# Altium schematic sheet Blue_Pill_v1.0.SchDoc
size OrCAD A; SheetNumber: 1; SheetTotal: 1
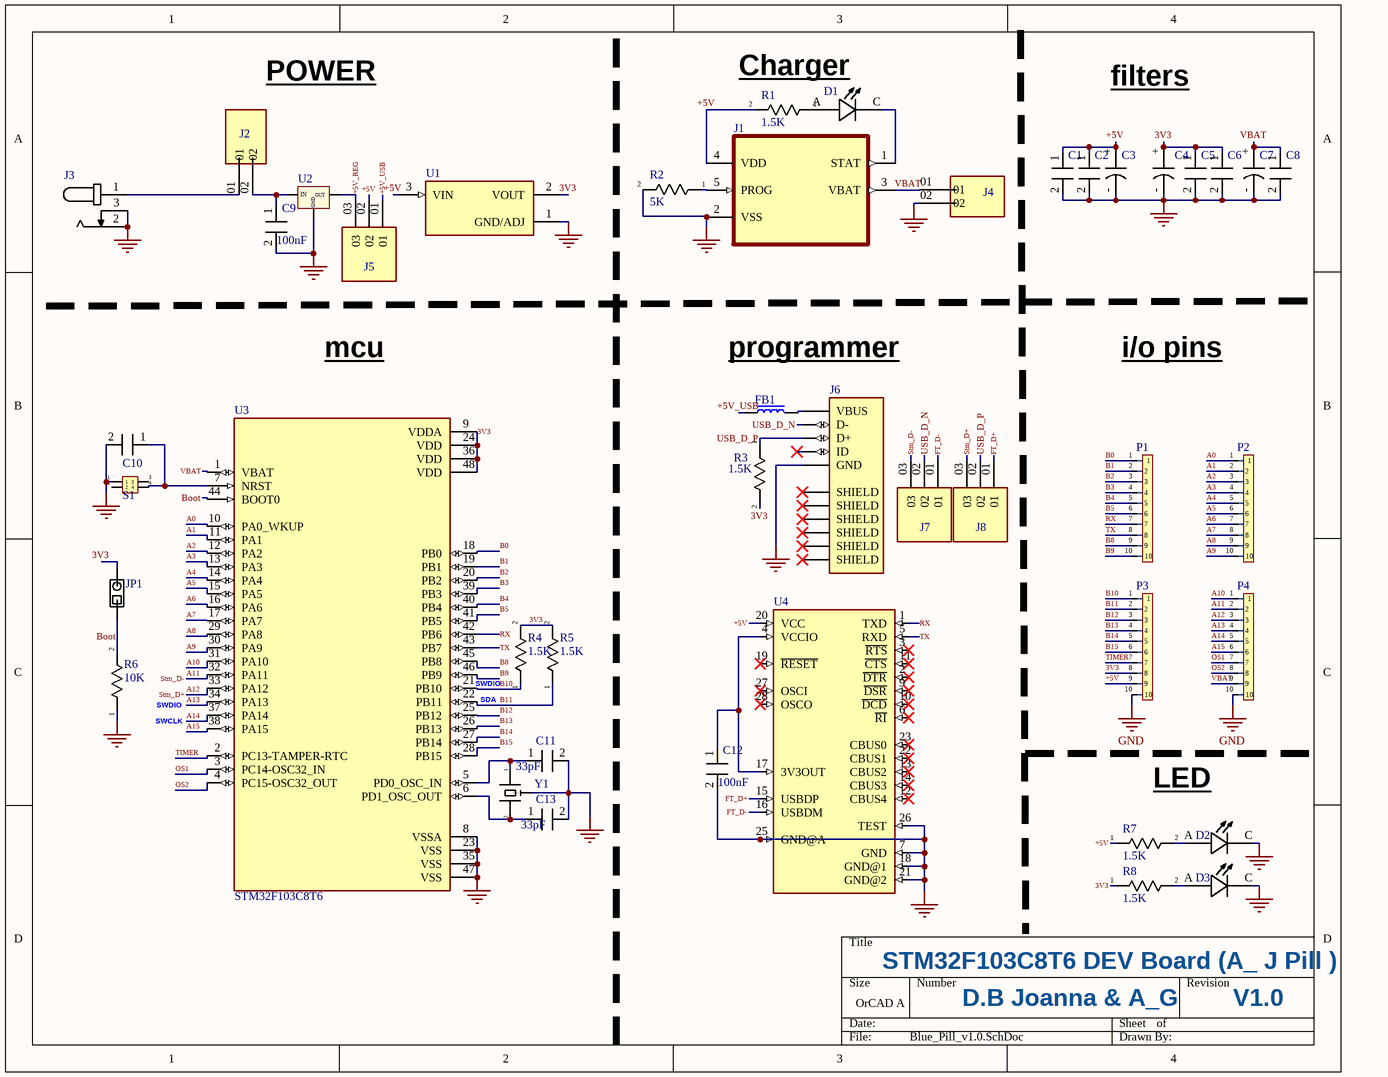
[diagram p0: Blue_Pill_v1.0.SchDoc]

## Parts
C1  10nF  [CL21B104KACNNNC]  (value not drawn)
C2  100nF  [CL21B104KACNNNC]  (value not drawn)
C3  2.2UF  [10SVP4R7M]  (value not drawn)
C4  2.2UF  [10SVP4R7M]  (value not drawn)
C5  100nF  [CL21B104KACNNNC]  (value not drawn)
C6  10nF  [CL21B104KACNNNC]  (value not drawn)
C7  2.2UF  [10SVP4R7M]  (value not drawn)
C8  100nF  [CL21B104KACNNNC]  (value not drawn)
C9  100nF  [CL21B104KACNNNC]
C10  100nF  [CL21B104KACNNNC]  (value not drawn)
C11  33pF  [CC0805JKX7R7BB105]
C12  100nF  [CL21B104KACNNNC]
C13  33pF  [CC0805JKX7R7BB105]
D1  LEDC2012X70N  [LEDC2012X70N]  (value not drawn)
D2  LEDC2012X70N  [LEDC2012X70N]  (value not drawn)
D3  LEDC2012X70N  [LEDC2012X70N]  (value not drawn)
FB1  FB0805  [FB_0805]  (value not drawn)
J1  MCP73831T-2ACI/OT  [MCP73831_SOT95P280X145-5N]  (value not drawn)
J2  PINHEADER_2_61300211121  [PINHEADER_2_WURTH_61300211121]  (value not drawn)
J3  PJ-002AH  [PJ-002AH]  (value not drawn)
J4  PINHEADER_2_61300211121  [PINHEADER_2_WURTH_61300211121]  (value not drawn)
J5  PinHead_M_TSW-103-07-G-S  [PinHeader_M_SAMTEC_TSW-103-07-G-S]  (value not drawn)
J6  USB_MICRO_USB3076-XX-X_REVC5  [USB_MICRO_GCT_USB3076-XX-X_REVC5]  (value not drawn)
J7  PinHead_M_TSW-103-07-G-S  [PinHeader_M_SAMTEC_TSW-103-07-G-S]  (value not drawn)
J8  PinHead_M_TSW-103-07-G-S  [PinHeader_M_SAMTEC_TSW-103-07-G-S]  (value not drawn)
JP1  Solder Jumper  [SolderJumper_Single]  (value not drawn)
P1  NPPN101BFCN-RC  [NPPN101BFCN-RC]  (value not drawn)
P2  NPPN101BFCN-RC  [NPPN101BFCN-RC]  (value not drawn)
P3  NPPN101BFCN-RC  [NPPN101BFCN-RC]  (value not drawn)
P4  NPPN101BFCN-RC  [NPPN101BFCN-RC]  (value not drawn)
R1  1.5K  [RMCF0805FT8K06]
R2  5K  [RMCF0805FT8K06]
R3  1.5K  [RMCF0805FT8K06]
R4  1.5K  [RMCF0805FT8K06]
R5  1.5K  [RMCF0805FT8K06]
R6  10K  [RMCF0805FT8K06]
R7  1.5K  [RMCF0805FT8K06]
R8  1.5K  [RMCF0805FT8K06]
S1  B3SL-1002P  [B3SL-1002P]  (value not drawn)
U1  AMS1117-3.3  [AMS11173v3_SOT229P700X180-4N]  (value not drawn)
U2  SPX1117M3-L-5-0/TR  [SPX1117M3-L-5-0/TR]  (value not drawn)
U3  STM32F103C8T6  [STM32F103C8T6]
U4  INTERFACE-FT232RL(SSOP28)  [fT2332_SSOP28-0.65-10.2X5.2MM]  (value not drawn)
Y1  CSTCE16M0V53-R0  [CSTCE16M0V53-R0]  (value not drawn)

## Nets
GND: C1.2 C2.2 C3.- C4.- C5.2 C6.2 C7.- C8.2 C9.2 C10.2 C11.2 C12.2 C13.2 D2.C D3.C J1.2(VSS) J3.2 J3.3 J4.02 J6.5(GND) P3.10 P4.10 R2.2 R6.1 S1.1 U1.1(GND/ADJ) U2.2(GND) U3.8(VSSA) U3.23(VSS) U3.35(VSS) U3.47(VSS) U4.7(GND) U4.18(GND@1) U4.21(GND@2) U4.25(GND@A) U4.26(TEST) Y1.Gnd
3V3: C4.+ C5.1 C6.1 JP1.2 P3.8 R3.2 R4.2 R5.2 R8.1 U1.2(VOUT) U3.9(VDDA) U3.24(VDD) U3.36(VDD) U3.48(VDD)
+5V: C1.1 C2.1 C3.+ J1.4(VDD) J5.02 P3.9 R1.2 R7.1 U1.3(VIN) U4.20(VCC)
+5V_REG: J5.03 U2.3(OUT)
+5V_USB: FB1.1 J5.01
A0: P2.1 U3.10(PA0_WKUP)
A1: P2.2 U3.11(PA1)
A2: P2.3 U3.12(PA2)
A3: P2.4 U3.13(PA3)
A4: P2.5 U3.14(PA4)
A5: P2.6 U3.15(PA5)
A6: P2.7 U3.16(PA6)
A7: P2.8 U3.17(PA7)
A8: P2.9 U3.29(PA8)
A9: P2.10 U3.30(PA9)
A10: P4.1 U3.31(PA10)
A11: J7.03 P4.2 U3.32(PA11)  [also labelled Stm_D-]
A12: J8.03 P4.3 U3.33(PA12)  [also labelled Stm_D+]
A13: P4.4 U3.34(PA13)
A14: P4.5 U3.37(PA14)
A15: P4.6 U3.38(PA15)
B0: P1.1 U3.18(PB0)
B1: P1.2 U3.19(PB1)
B2: P1.3 U3.20(PB2)
B3: P1.4 U3.39(PB3)
B4: P1.5 U3.40(PB4)
B5: P1.6 U3.41(PB5)
B8: P1.9 U3.45(PB8)
B9: P1.10 U3.46(PB9)
B10: P3.1 R4.1 U3.21(PB10)
B11: P3.2 R5.1 U3.22(PB11)
B12: P3.3 U3.25(PB12)
B13: P3.4 U3.26(PB13)
B14: P3.5 U3.27(PB14)
B15: P3.6 U3.28(PB15)
Boot: JP1.1 R6.2 U3.44(BOOT0)
FT_D+: J8.01 U4.15(USBDP)
FT_D-: J7.01 U4.16(USBDM)
OS1: P4.7 U3.3(PC14-OSC32_IN)
OS2: P4.8 U3.4(PC15-OSC32_OUT)
RX: P1.7 U3.42(PB6) U4.1(TXD)
TIMER: P3.7 U3.2(PC13-TAMPER-RTC)
TX: P1.8 U3.43(PB7) U4.5(RXD)
USB_D_N: J6.2(D-) J7.02
USB_D_P: J6.3(D+) J8.02 R3.1
VBAT: C7.+ C8.1 J1.3(VBAT) J4.01 P4.9 U3.1(VBAT)
NetC9_1: C9.1 J2.02 U2.1(IN)
NetC10_1: C10.1 S1.4 U3.7(NRST)
NetC11_1: C11.1 U3.5(PD0_OSC_IN) Y1.1
NetC12_1: C12.1 U4.4(VCCIO) U4.17(3V3OUT)
NetC13_1: C13.1 U3.6(PD1_OSC_OUT) Y1.2
NetD1_A: D1.A R1.1
NetD1_C: D1.C J1.1(STAT)
NetD2_A: D2.A R7.2
NetD3_A: D3.A R8.2
NetFB1_2: FB1.2 J6.1(VBUS)
NetJ1_5: J1.5(PROG) R2.1
NetJ2_01: J2.01 J3.1

Not connected (* = marked no-connect by the designer): J6 4(ID)* 6(SHIELD)* 7(SHIELD)* 8(SHIELD)* 9(SHIELD)* 10(SHIELD)* 11(SHIELD)*; S1 2 3; U4 2(~{DTR})* 3(~{RTS})* 6(~{RI})* 9(~{DSR})* 10(~{DCD})* 11(~{CTS})* 12(CBUS4)* 13(CBUS2)* 14(CBUS3)* 19(~{RESET})* 22(CBUS1)* 23(CBUS0)* 27(OSCI)* 28(OSCO)*

## Notes on the sheet
- POWER
- Charger
- filters
- mcu
- programmer
- i/o pins
- SWDIO
- SDA
- SWCLK
- LED
- STM32F103C8T6 DEV Board (A_ J Pill )
- D.B Joanna & A_G
- V1.0

## Library data of the parts
C1 C2 C5 C6 C8-C10 C12 = CL21B104KACNNNC: 0.1 µF ±10% 25V Ceramic Capacitor X7R 0805 (2012 Metric); Value: CAP CER 0.1UF 25V X7R 0805; P/N: CL21B104KACNNNC; Digi Key Link: https://www.digikey.com/en/products/detail/samsung-electro-mechanics/CL21B104KACNNNC/3886757
C3 C4 C7 = 10SVP4R7M: 4.7 µF 10 V Aluminum - Polymer Capacitors Radial, Can - SMD 240mOhm 2000 Hrs @ 105°C; Value: CAP ALUM POLY 4.7UF 20% 10V SMD; P/N: 10SVP4R7M; Digi Key Link: https://www.digikey.com/en/products/detail/panasonic-electronic-components/10SVP4R7M/4204769
C11 C13 = CC0805JKX7R7BB105: 1 µF ±5% 16V Ceramic Capacitor X7R 0805 (2012 Metric); P/N: CC0805JKX7R7BB105; Value: 1 µF ±5% 16V; Digi Key Link: https://www.digikey.com/en/products/detail/yageo/CC0805JKX7R7BB105/7164381
D1-D3 = LEDC2012X70N: SMD LED 0805; P/N: LEDC2012X70N
FB1 = FB_0805: Ferrite Bead SMD 0805; Manufacturer: *; Manufacturer Part Number: *; Distributor Link: *; LCSC: *
J1 = MCP73831T-2ACI/OT: Charger IC Lithium Ion/Polymer SOT-23-5; MF: Microchip; Package: SOT-23 Microchip; Purchase-URL: https://pricing.snapeda.com/search/part/MCP73831T-2ACI/OT/?ref=eda; MP: MCP73831T-2ACI/OT; Value: *; Availability: In Stock; SnapEDA_Link: https://www.snapeda.com/parts/MCP73831T-2ACI/OT/Microchip/view-part/?ref=snap; Price: None; Check_prices: https://www.snapeda.com/parts/MCP73831T-2ACI/OT/Microchip/view-part/?ref=eda
J2 J4 = PINHEADER_2_61300211121: Connector Header Through Hole 2 position 0.100 (2.54mm); MF: Wurth Elektronik; SnapEDA_Link: https://www.snapeda.com/parts/61300211121/Wurth+Elektronik/view-part/?ref=snap; Package: None; Value: *; MP: 61300211121; Check_prices: https://www.snapeda.com/parts/61300211121/Wurth+Elektronik/view-part/?ref=eda
J3 = PJ-002AH: 2.0 x 6.5 mm, 5.0 A, Horizontal, Through Hole, Dc Power Jack Connector; P/N: PJ-002AH
J5 J7 J8 = PinHead_M_TSW-103-07-G-S: <a href="https://pricing.snapeda.com/parts/TSW-103-07-G-S/Samtec/view-part?ref=eda">Check availability</a>; MP: altium_native_batch; Package: None; Price: None; Value: *; Availability: Unavailable
J6 = USB_MICRO_USB3076-XX-X_REVC5: USB - micro B USB 2.0 Receptacle Connector 5 Position Surface Mount, Right Angle; Through Hole, 2.35mm profile, 5 Pins, Horizontal, Bottom mount; MP: USB3076-30-A; MF: Global Connector Technology; SnapEDA_Link: https://www.snapeda.com/parts/USB3076-30-A/Global+Connector+Technology/view-part/?ref=snap; Package: None; Check_prices: https://www.snapeda.com/parts/USB3076-30-A/Global+Connector+Technology/view-part/?ref=eda; Purchase-URL: https://pricing.snapeda.com/search/part/USB3076-30-A/?ref=eda; Price: None; Value: *; Availability: In Stock
JP1 = SolderJumper_Single: Solder Jumper Single 0.5mm Pitch
P1-P4 = NPPN101BFCN-RC: 10 Position Header Connector 0.079" (2.00mm) Through Hole Gold
R1-R8 = RMCF0805FT8K06: 8.06 kOhms ±1% 0.125W, 1/8W Chip Resistor 0805 (2012 Metric) Automotive AEC-Q200 Thick Film; Value: 8.06K; P/N: RMCF0805FT8K06
S1 = B3SL-1002P: Tactile Switch SPST-NO Top Actuated Surface Mount
U1 = AMS1117-3.3: Sot223/Pkg 1-Amp 3.3-Volt Low Drop Out Voltage Regulatator; MF: Advanced Monolithic Systems; Package: SOT-223 Seeed Technology; Value: *; Check_prices: https://www.snapeda.com/parts/AMS1117-3.3/Advanced+Monolithic+Systems/view-part/?ref=eda; Price: None; Availability: Not in stock; MP: AMS1117-3.3; SnapEDA_Link: https://www.snapeda.com/parts/AMS1117-3.3/Advanced+Monolithic+Systems/view-part/?ref=snap
U2 = SPX1117M3-L-5-0/TR: Linear Voltage Regulator IC Positive Fixed 1 Output 800mA SOT-223-3
U3 = STM32F103C8T6: ARM® Cortex®-M3 STM32F1 Microcontroller IC 32-Bit 72MHz 64KB (64K x 8) FLASH 48-LQFP (7x7); MF: STMicroelectronics; SnapEDA_Link: https://www.snapeda.com/parts/STM32F103C8T6/STMicroelectronics/view-part/?ref=snap; Package: LQFP-48 STMicroelectronics; Value: *; MP: STM32F103C8T6; Check_prices: https://www.snapeda.com/parts/STM32F103C8T6/STMicroelectronics/view-part/?ref=eda
U4 = INTERFACE-FT232RL(SSOP28): USB-Ð¼Ð¾ÑÑ‚, Ð¸Ð½Ñ‚ÐµÑ€Ñ„ÐµÐ¹Ñ USB Ðº UART USB 2.0 UART 28-SSOP; MF: FTDI, Future; SnapEDA_Link: https://www.snapeda.com/parts/FT232RL/FTDI%252C+Future+Technology+Devices+International+Ltd/view-part/?ref=snap; Availability: Not in stock; MP: FT232RL; Price: None; Value: *; Check_prices: https://www.snapeda.com/parts/FT232RL/FTDI%252C+Future+Technology+Devices+International+Ltd/view-part/?ref=eda; Package: SSOP-28 FTDI
Y1 = CSTCE16M0V53-R0: 16 MHz Ceramic Resonator Built in Capacitor 15 pF ±0.3% -20°C ~ 80°C Surface Mount